# EAGLE schematic AVRtest (EAGLE 7.2.0)
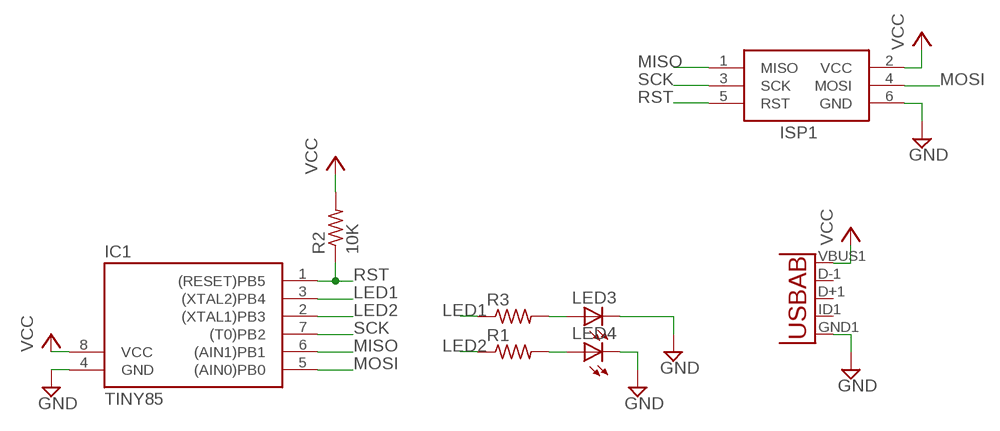
[diagram p0: schematic, sheet 1]

## Parts
IC1  TINY85  TINY10S  [SOIC8]
ISP1  AVRISP-6  [AVRISP]
LED3  LEDCHIPLED_0805  [CHIPLED_0805]
LED4  LEDCHIPLED_0805  [CHIPLED_0805]
R1  R-US_R0805  [R0805]
R2  10K  R-US_R0805  [R0805]
R3  R-US_R0805  [R0805]
U1  USB""  [USB-MICRO-SMD]

## Nets
GND: IC1.4(GND) ISP1.6(GND) LED3.C LED4.C U1.GND1(GND)
LED1: IC1.3((XTAL2)PB4) R3.1
LED2: IC1.2((XTAL1)PB3) R1.1
MISO: IC1.6((AIN1)PB1) ISP1.1(MISO)
MOSI: IC1.5((AIN0)PB0) ISP1.4(MOSI)
N$1: LED3.A R3.2
N$2: LED4.A R1.2
RST: IC1.1((RESET)PB5) ISP1.5(RST) R2.1
SCK: IC1.7((T0)PB2) ISP1.3(SCK)
VCC: IC1.8(VCC) ISP1.2(VCC) R2.2 U1.VBUS1(VBUS)
Unconnected: U1.D+1(D+) U1.D-1(D-) U1.ID1(USBID)

## Library data of the parts
IC1 = atmel:TINY10: MICROCONTROLLER 1 Kbytes ROM; OC_FARNELL: unknown; OC_NEWARK: unknown
ISP1 = adafruit:AVRISP: AVR ISP HEADER Standard 6 pin header for AVR programming
LED3 LED4 = adafruit:LED: LED OSRAM: - CHIPLED LG R971, LG N971, LY N971, LG Q971, LY Q971, LO R971, LY R971 LH N974, LH R974 LS Q976, LO Q976, LY Q976 LO Q996 - Hyper CHIPLED LW Q18S LB Q993, LB Q99A, LB R99A - SideLED LS A670, LO A670, LY A670, LG A670, LP A670 LB A673, LV A673, LT A673, LW A673 LH A674 LY A675 LS A676, LA A676, LO A676, LY A676, LW A676 LS A679, LY A679, LG A679 - Hyper Micro SIDELED® LS Y876, LA Y876, LO Y876, LY Y876 LT Y87S - SmartLED LW L88C, LW L88S LB L89C, LB L89S, LG L890 LS L89K, LO L89K, LY L89K LS L896, LA L896, LO L896, LY L896 - TOPLED LS T670, LO T670, LY T670, LG T670, LP T670 LSG T670, LSP T670, LSY T670, LOP T670, LYG T670 LG T671, LOG T671, LSG T671 LB T673, LV T673, LT T673, LW T673 LH T674 LS T676, LA T676, LO T676, LY T676, LB T676, LH T676, LSB T676, LW T676 LB T67C, LV T67C, LT T67C, LS T67K, LO T67K, LY T67K, LW E67C LS E67B, LA E67B, LO E67B, LY E67B, LB E67C, LV E67C, LT E67C LW T67C LS T679, LY T679, LG T679 LS T770, LO T770, LY T770, LG T770, LP T770 LB T773, LV T773, LT T773, LW T773 LH T774 LS E675, LA E675, LY E675, LS T675 LS T776, LA T776, LO T776, LY T776, LB T776 LHGB T686 LT T68C, LB T68C - Hyper Mini TOPLED® LB M676 - Mini TOPLED Santana® LG M470 LS M47K, LO M47K, LY M47K Source: http://www.osram.convergy.de/
R1-R3 = rcl:R-US_: RESISTOR, American symbol
U1 = MicroUSB:USB: This is a USB AB connector that is compatible with USB OTG. i.e. this connector can serve as a host or device